# Altium schematic sheet Sheet1.SCHDOC
size 508 x 508 mm; SheetNumber: 1; SheetTotal: 1; DocumentName: Sheet1.SCHDOC
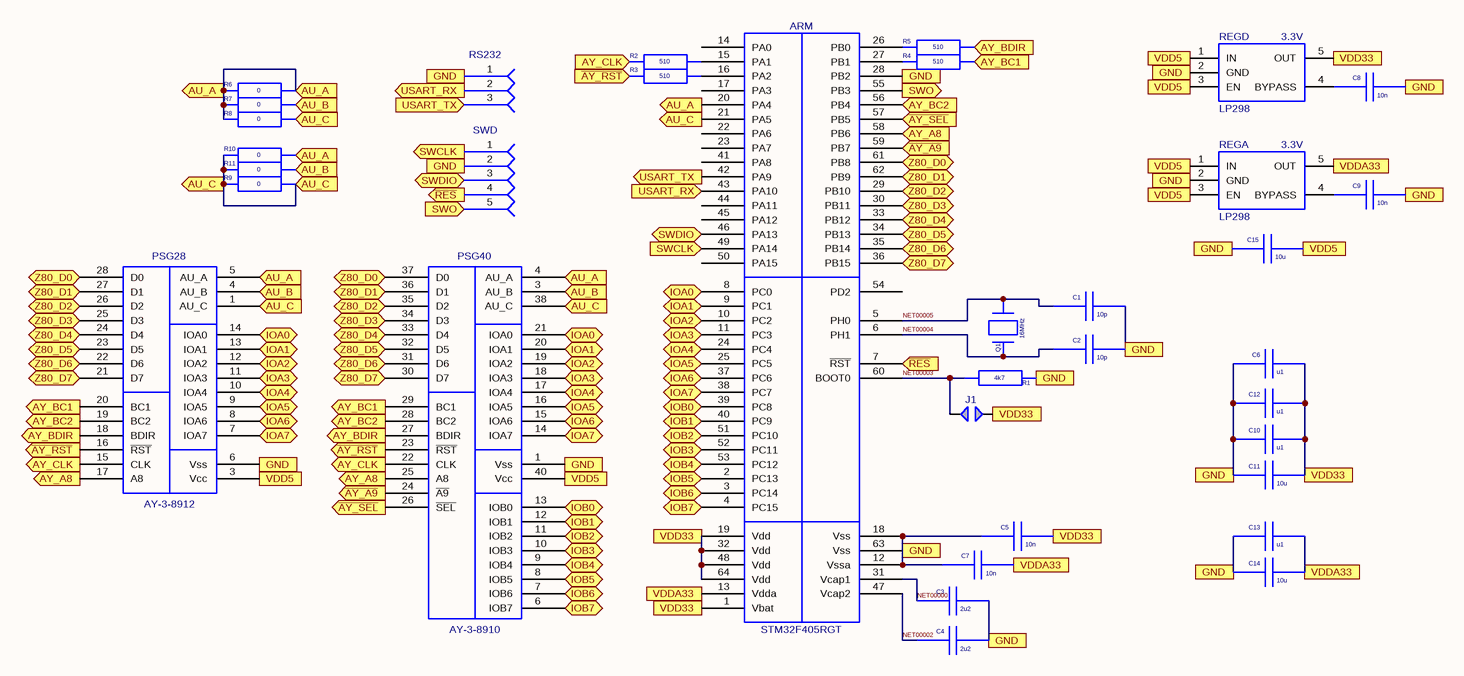
[diagram p0: Sheet1.SCHDOC]

## Parts
ARM  STM32F405RGT  [LQFP-10X10-64_STM32F405RGT()]
C1  value 10p  [SMD-1608-0603_CAP-1608-0603()]  (hidden comment: CAP-1608-0603)
C2  value 10p  [SMD-1608-0603_CAP-1608-0603()]  (hidden comment: CAP-1608-0603)
C3  value 2u2  [SMD-1608-0603_CAP-1608-0603()]  (hidden comment: CAP-1608-0603)
C4  value 2u2  [SMD-1608-0603_CAP-1608-0603()]  (hidden comment: CAP-1608-0603)
C5  value 10n  [SMD-1608-0603_CAP-1608-0603()]  (hidden comment: CAP-1608-0603)
C6  value u1  [SMD-1608-0603_CAP-1608-0603()]  (hidden comment: CAP-1608-0603)
C7  value 10n  [SMD-1608-0603_CAP-1608-0603()]  (hidden comment: CAP-1608-0603)
C8  value 10n  [SMD-1608-0603_CAP-1608-0603()]  (hidden comment: CAP-1608-0603)
C9  value 10n  [SMD-1608-0603_CAP-1608-0603()]  (hidden comment: CAP-1608-0603)
C10  value u1  [SMD-1608-0603_CAP-1608-0603()]  (hidden comment: CAP-1608-0603)
C11  value 10u  [SMD-1608-0603_CAP-1608-0603()]  (hidden comment: CAP-1608-0603)
C12  value u1  [SMD-1608-0603_CAP-1608-0603()]  (hidden comment: CAP-1608-0603)
C13  value u1  [SMD-1608-0603_CAP-1608-0603()]  (hidden comment: CAP-1608-0603)
C14  value 10u  [SMD-1608-0603_CAP-1608-0603()]  (hidden comment: CAP-1608-0603)
C15  value 10u  [SMD-1608-0603_CAP-1608-0603()]  (hidden comment: CAP-1608-0603)
J1  JUMPER  [JUMPER_JUMPER()]  (value not drawn)
PSG28  AY-3-8912  [DIP28_AY-3-8912()]
PSG40  AY-3-8910  [DIP40_AY-3-8910()]
Q1  value 16MHz  [WATCH-XTAL_CRYSTAL-WATCH()]  (hidden comment: CRYSTAL-WATCH)
R1  value 4k7  [SMD-1608-0603_RES-1608-0603()]  (hidden comment: RES-1608-0603)
R2  value 510  [SMD-1608-0603_RES-1608-0603()]  (hidden comment: RES-1608-0603)
R3  value 510  [SMD-1608-0603_RES-1608-0603()]  (hidden comment: RES-1608-0603)
R4  value 510  [SMD-1608-0603_RES-1608-0603()]  (hidden comment: RES-1608-0603)
R5  value 510  [SMD-1608-0603_RES-1608-0603()]  (hidden comment: RES-1608-0603)
R6  value 0  [SMD-1608-0603_RES-1608-0603()]  (hidden comment: RES-1608-0603)
R7  value 0  [SMD-1608-0603_RES-1608-0603()]  (hidden comment: RES-1608-0603)
R8  value 0  [SMD-1608-0603_RES-1608-0603()]  (hidden comment: RES-1608-0603)
R9  value 0  [SMD-1608-0603_RES-1608-0603()]  (hidden comment: RES-1608-0603)
R10  value 0  [SMD-1608-0603_RES-1608-0603()]  (hidden comment: RES-1608-0603)
R11  value 0  [SMD-1608-0603_RES-1608-0603()]  (hidden comment: RES-1608-0603)
REGA  LP298  value 3.3V  [SOT23-5_LP298()]
REGD  LP298  value 3.3V  [SOT23-5_LP298()]
RS232  DIP-HDR-3  [DIP-HEAD-3_DIP-HDR-3()]  (value not drawn)
SWD  DIP-HDR-5  [DIP-HEAD-5_DIP-HDR-5()]  (value not drawn)

## Ports
AU_A (in), AU_A (out), AU_B (in), AU_C (in), AU_C (out), AY_A8 (in), AY_A8 (out), AY_BC1 (in), AY_BC1 (out), AY_BC2 (in), AY_BC2 (out), AY_BDIR (in), AY_BDIR (out), AY_CLK (in), AY_CLK (out), GND, IOA0 (bidir), IOA1 (bidir), IOA2 (bidir), IOA3 (bidir), IOA4 (bidir), IOA5 (bidir), IOA6 (bidir), IOA7 (bidir), IOB0 (bidir), IOB1 (bidir), IOB2 (bidir), IOB3 (bidir), IOB4 (bidir), IOB5 (bidir), IOB6 (bidir), IOB7 (bidir), SWCLK (in), SWCLK (out), SWDIO (bidir), SWO (in), SWO (out), USART_RX (in), USART_RX (out), USART_TX (in), USART_TX (out), VDD5, VDD33, VDDA33, Z80_D0 (bidir), Z80_D1 (bidir), Z80_D2 (bidir), Z80_D3 (bidir), Z80_D4 (bidir), Z80_D5 (bidir), Z80_D6 (bidir), Z80_D7 (bidir), ~{AY_A9} (in), ~{AY_A9} (out), ~{AY_RST} (in), ~{AY_RST} (out), ~{AY_SEL} (in), ~{AY_SEL} (out), ~{RES} (in), ~{RES} (out)

## Nets
~{AY_A9}: ARM.59(PB7) PSG40.24(~{A9}) ; port ~{AY_A9}
~{AY_RST}: PSG28.16(~{RST}) PSG40.23(~{RST}) R3.1(i/o) ; port ~{AY_RST}
~{AY_SEL}: ARM.57(PB5) PSG40.26(~{SEL}) ; port ~{AY_SEL}
AU_A: ARM.20(PA4) PSG28.5(AU_A) PSG40.4(AU_A) R6.1(i/o) R6.2(i/o1) R7.1(i/o) R8.1(i/o) R10.2(i/o1) ; port AU_A
AU_B: PSG28.4(AU_B) PSG40.3(AU_B) R7.2(i/o1) R11.2(i/o1) ; port AU_B
AU_C: ARM.21(PA5) PSG28.1(AU_C) PSG40.38(AU_C) R8.2(i/o1) R9.1(i/o) R9.2(i/o1) R10.1(i/o) R11.1(i/o) ; port AU_C
AY_A8: ARM.58(PB6) PSG28.17(A8) PSG40.25(A8) ; port AY_A8
AY_BC1: PSG28.20(BC1) PSG40.29(BC1) R4.2(i/o1) ; port AY_BC1
AY_BC2: ARM.56(PB4) PSG28.19(BC2) PSG40.28(BC2) ; port AY_BC2
AY_BDIR: PSG28.18(BDIR) PSG40.27(BDIR) R5.2(i/o1) ; port AY_BDIR
AY_CLK: PSG28.15(CLK) PSG40.22(CLK) R2.1(i/o) ; port AY_CLK
GND: ARM.12(Vssa) ARM.18(Vss) ARM.28(PB2) ARM.63(Vss) C1.2 C2.2 C3.2 C4.2 C5.1 C6.1 C7.1 C8.2 C9.2 C10.1 C11.1 C12.1 C13.1 C14.1 C15.1 PSG28.6(Vss) PSG40.1(Vss) R1.2(i/o1) REGA.2(GND) REGD.2(GND) RS232.1 SWD.2 ; port GND
IOA0: ARM.8(PC0) PSG28.14(IOA0) PSG40.21(IOA0) ; port IOA0
IOA1: ARM.9(PC1) PSG28.13(IOA1) PSG40.20(IOA1) ; port IOA1
IOA2: ARM.10(PC2) PSG28.12(IOA2) PSG40.19(IOA2) ; port IOA2
IOA3: ARM.11(PC3) PSG28.11(IOA3) PSG40.18(IOA3) ; port IOA3
IOA4: ARM.24(PC4) PSG28.10(IOA4) PSG40.17(IOA4) ; port IOA4
IOA5: ARM.25(PC5) PSG28.9(IOA5) PSG40.16(IOA5) ; port IOA5
IOA6: ARM.37(PC6) PSG28.8(IOA6) PSG40.15(IOA6) ; port IOA6
IOA7: ARM.38(PC7) PSG28.7(IOA7) PSG40.14(IOA7) ; port IOA7
IOB0: ARM.39(PC8) PSG40.13(IOB0) ; port IOB0
IOB1: ARM.40(PC9) PSG40.12(IOB1) ; port IOB1
IOB2: ARM.51(PC10) PSG40.11(IOB2) ; port IOB2
IOB3: ARM.52(PC11) PSG40.10(IOB3) ; port IOB3
IOB4: ARM.53(PC12) PSG40.9(IOB4) ; port IOB4
IOB5: ARM.2(PC13) PSG40.8(IOB5) ; port IOB5
IOB6: ARM.3(PC14) PSG40.7(IOB6) ; port IOB6
IOB7: ARM.4(PC15) PSG40.6(IOB7) ; port IOB7
NET00000: ARM.31(Vcap1) C3.1
NET00002: ARM.47(Vcap2) C4.1
NET00003: ARM.60(BOOT0) J1.0 R1.1(i/o)
NET00004: ARM.6(PH1) C2.1 Q1.A
NET00005: ARM.5(PH0) C1.1 Q1.B
~{RES}: ARM.7(~{RST}) SWD.4 ; port ~{RES}
SWCLK: ARM.49(PA14) SWD.1 ; port SWCLK
SWDIO: ARM.46(PA13) SWD.3 ; port SWDIO
SWO: ARM.55(PB3) SWD.5 ; port SWO
USART_RX: ARM.43(PA10) RS232.2 ; port USART_RX
USART_TX: ARM.42(PA9) RS232.3 ; port USART_TX
VDD5: C15.2 PSG28.3(Vcc) PSG40.40(Vcc) REGA.1(IN) REGA.3(EN) REGD.1(IN) REGD.3(EN) ; port VDD5
VDD33: ARM.1(Vbat) ARM.19(Vdd) ARM.32(Vdd) ARM.48(Vdd) ARM.64(Vdd) C5.2 C6.2 C10.2 C11.2 C12.2 J1.1 REGD.5(OUT) ; port VDD33
VDDA33: ARM.13(Vdda) C7.2 C13.2 C14.2 REGA.5(OUT) ; port VDDA33
Z80_D0: ARM.61(PB8) PSG28.28(D0) PSG40.37(D0) ; port Z80_D0
Z80_D1: ARM.62(PB9) PSG28.27(D1) PSG40.36(D1) ; port Z80_D1
Z80_D2: ARM.29(PB10) PSG28.26(D2) PSG40.35(D2) ; port Z80_D2
Z80_D3: ARM.30(PB11) PSG28.25(D3) PSG40.34(D3) ; port Z80_D3
Z80_D4: ARM.33(PB12) PSG28.24(D4) PSG40.33(D4) ; port Z80_D4
Z80_D5: ARM.34(PB13) PSG28.23(D5) PSG40.32(D5) ; port Z80_D5
Z80_D6: ARM.35(PB14) PSG28.22(D6) PSG40.31(D6) ; port Z80_D6
Z80_D7: ARM.36(PB15) PSG28.21(D7) PSG40.30(D7) ; port Z80_D7
NetARM_15: ARM.15(PA1) R2.2(i/o1)
NetARM_16: ARM.16(PA2) R3.2(i/o1)
NetARM_26: ARM.26(PB0) R5.1(i/o)
NetARM_27: ARM.27(PB1) R4.1(i/o)
NetC8_1: C8.1 REGD.4(BYPASS)
NetC9_1: C9.1 REGA.4(BYPASS)

Not connected (* = marked no-connect by the designer): ARM 14(PA0) 17(PA3) 22(PA6) 23(PA7) 41(PA8) 44(PA11) 45(PA12) 50(PA15) 54(PD2); PSG28 2; PSG40 2 5 39

## Library data of the parts
ARM = STM32F405RGT: Value: *
PSG28 = AY-3-8912: Value: *
PSG40 = AY-3-8910: Value: *
Q1 = CRYSTAL-WATCH: Description: Crystal
SWD = DIP-HDR-5: Value: *